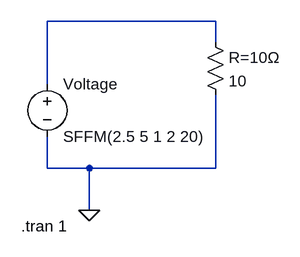
[diagram p0: schematic sffm.asc]
sffm.asc, the LTspice schematic file:
Version 4
SHEET 1 880 680
WIRE 96 32 -160 32
WIRE 96 64 96 32
WIRE -160 128 -160 32
WIRE -160 256 -160 208
WIRE -96 256 -160 256
WIRE 96 256 96 144
WIRE 96 256 -96 256
WIRE -96 320 -96 256
FLAG -96 320 0
SYMBOL voltage -160 112 R0
WINDOW 123 0 0 Left 0
WINDOW 39 0 0 Left 0
SYMATTR InstName Voltage
SYMATTR Value SFFM(2.5 5 1 2 20)
SYMBOL res 80 48 R0
SYMATTR InstName R=10Ω
SYMATTR Value 10
TEXT -200 344 Left 2 !.tran 1

The netlist it stands for:
* sffm.asc
Voltage N001 0 SFFM(2.5 5 1 2 20)
R=10Ω N001 0 10
.tran 1
.backanno
.end